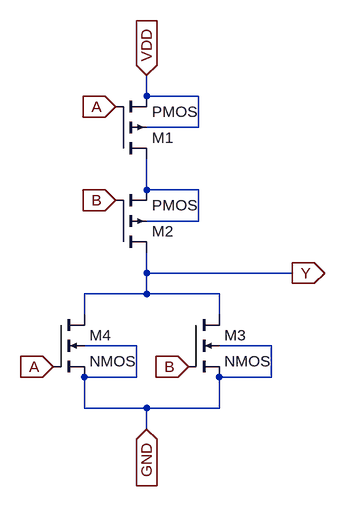
[diagram p0: schematic NOR_SYM.asc]
NOR_SYM.asc, the LTspice schematic file:
Version 4
SHEET 1 880 680
WIRE -192 -208 -192 -240
WIRE -112 -208 -192 -208
WIRE -112 -160 -112 -208
WIRE -112 -160 -192 -160
WIRE -192 -64 -192 -112
WIRE -112 -64 -192 -64
WIRE -112 -16 -112 -64
WIRE -112 -16 -192 -16
WIRE -192 64 -192 32
WIRE 32 64 -192 64
WIRE -192 96 -192 64
WIRE -192 96 -288 96
WIRE -80 96 -192 96
WIRE -288 128 -288 96
WIRE -80 128 -80 96
WIRE -208 176 -288 176
WIRE 0 176 -80 176
WIRE -208 224 -208 176
WIRE -208 224 -288 224
WIRE 0 224 0 176
WIRE 0 224 -80 224
WIRE -288 272 -288 224
WIRE -192 272 -288 272
WIRE -80 272 -80 224
WIRE -80 272 -192 272
WIRE -192 304 -192 272
FLAG -192 -240 VDD
IOPIN -192 -240 In
FLAG -192 304 GND
IOPIN -192 304 In
FLAG -336 208 A
IOPIN -336 208 In
FLAG -128 208 B
IOPIN -128 208 In
FLAG -240 -192 A
IOPIN -240 -192 In
FLAG -240 -48 B
IOPIN -240 -48 In
FLAG 32 64 Y
IOPIN 32 64 Out
SYMBOL pmos4 -240 -112 M180
SYMATTR InstName M1
SYMBOL pmos4 -240 32 M180
SYMATTR InstName M2
SYMBOL nmos4 -128 128 R0
SYMATTR InstName M3
SYMBOL nmos4 -336 128 R0
SYMATTR InstName M4

The netlist it stands for:
* NOR_SYM.asc
M1 N001 A VDD VDD PMOS
M2 Y B N001 N001 PMOS
M3 Y B GND GND NMOS
M4 Y A GND GND NMOS
.model NMOS NMOS
.model PMOS PMOS
.lib standard.mos
.backanno
.end